# EAGLE schematic stim (EAGLE 7.1.0)
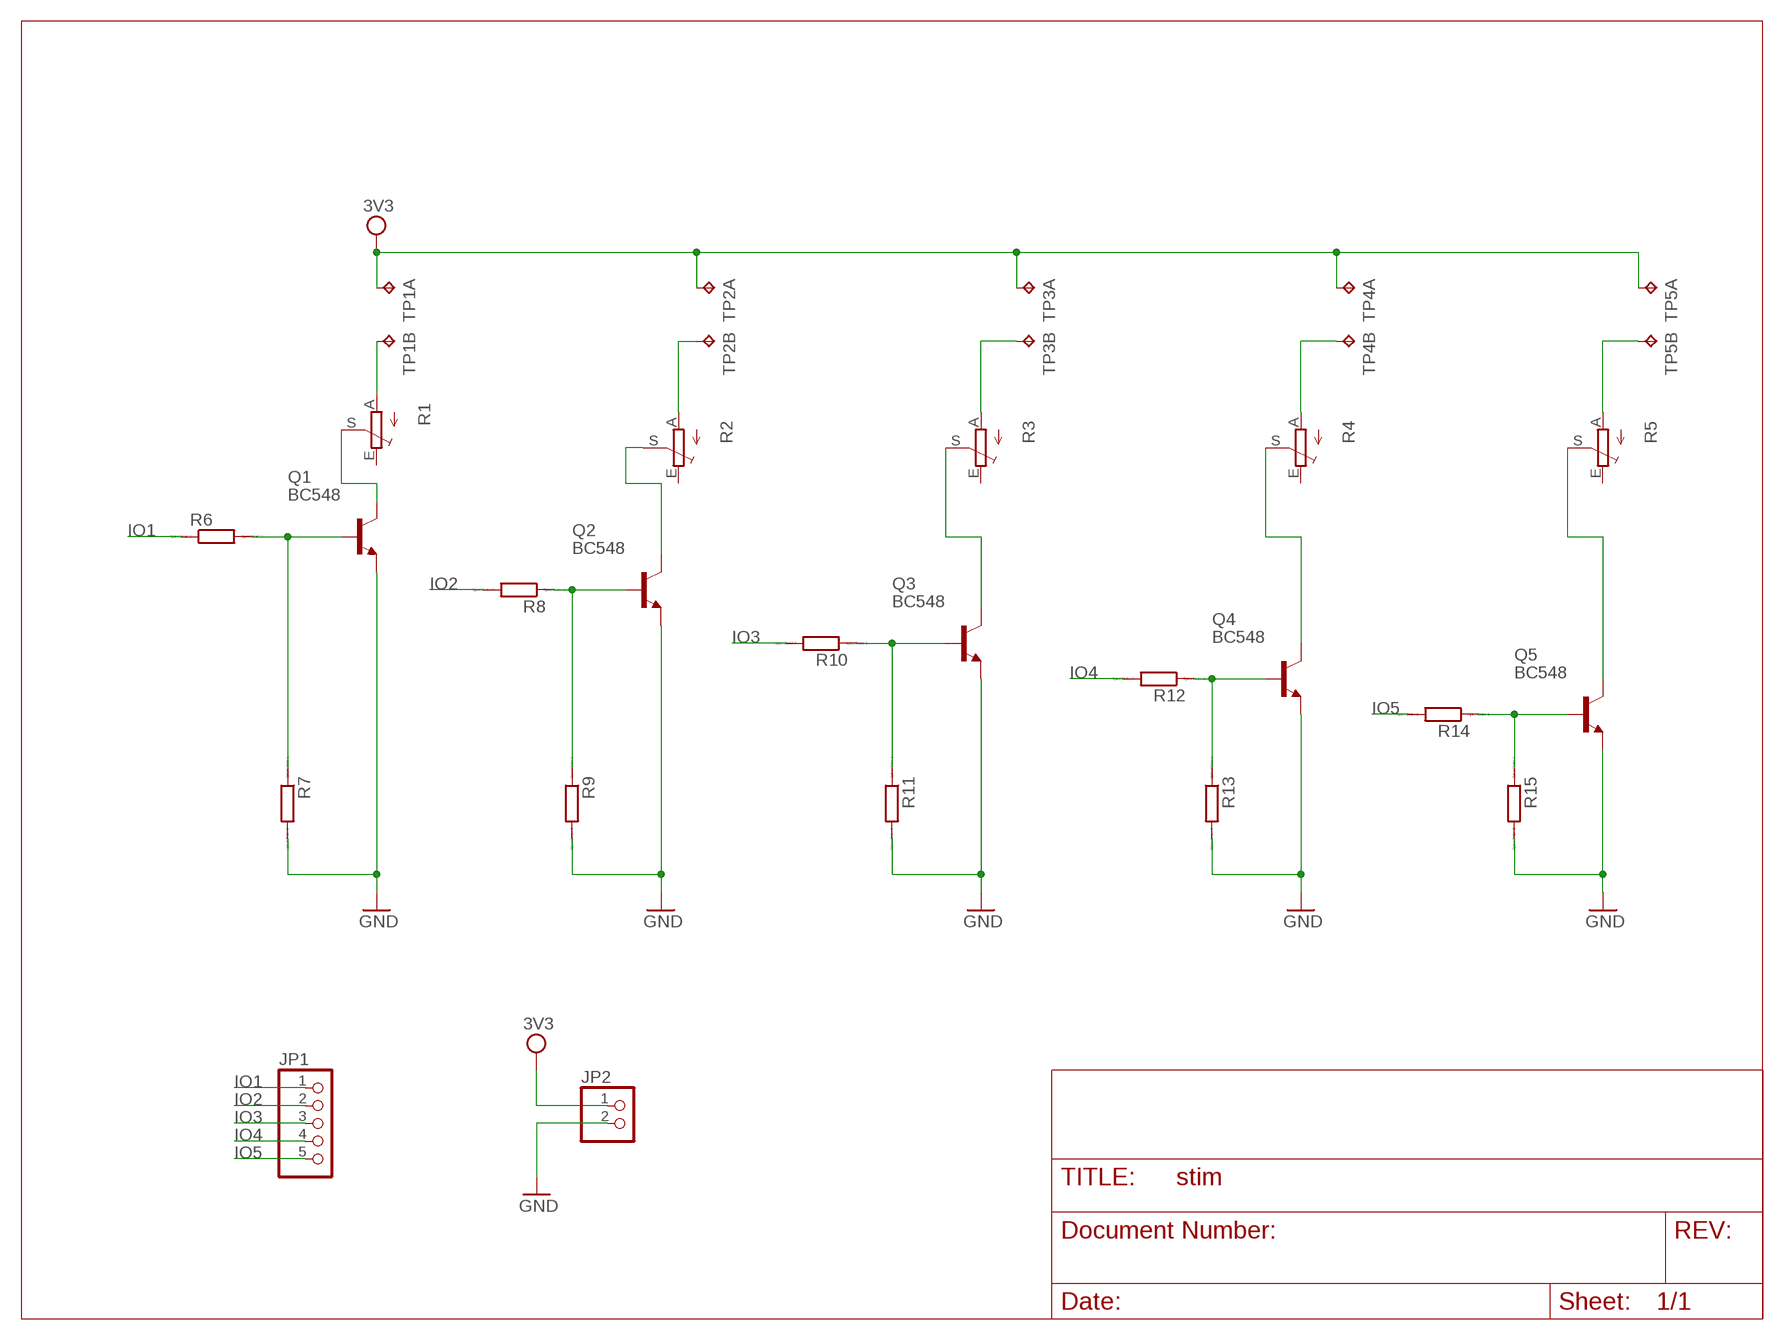
[diagram p0: schematic, sheet 1]

## Parts
JP1  PINHD-1X5  [1X05]
JP2  PINHD-1X2  [1X02]
Q1  BC548  [TO92-EBC]
Q2  BC548  [TO92-EBC]
Q3  BC548  [TO92-EBC]
Q4  BC548  [TO92-EBC]
Q5  BC548  [TO92-EBC]
R1  TRIM_EU-B25V  [B25V]
R2  TRIM_EU-B25V  [B25V]
R3  TRIM_EU-B25V  [B25V]
R4  TRIM_EU-B25V  [B25V]
R5  TRIM_EU-B25V  [B25V]
R6  RR1206  [R1206]
R7  RR1206  [R1206]
R8  RR1206  [R1206]
R9  RR1206  [R1206]
R10  RR1206  [R1206]
R11  RR1206  [R1206]
R12  RR1206  [R1206]
R13  RR1206  [R1206]
R14  RR1206  [R1206]
R15  RR1206  [R1206]
TP1  TP2P2-38-17  [P2-38-17]
TP2  TP2P2-38-17  [P2-38-17]
TP3  TP2P2-38-17  [P2-38-17]
TP4  TP2P2-38-17  [P2-38-17]
TP5  TP2P2-38-17  [P2-38-17]

## Nets
GND: JP2.2 Q1.E Q2.E Q3.E Q4.E Q5.E R7.2 R9.2 R11.2 R13.2 R15.2
IO1: JP1.1 R6.1
IO2: JP1.2 R8.2
IO3: JP1.3 R10.2
IO4: JP1.4 R12.2
IO5: JP1.5 R14.2
N$1: R2.A TP2.TP-2
N$2: R3.A TP3.TP-2
N$3: Q3.C R3.S
N$4: Q1.C R1.S
N$5: Q5.B R14.1 R15.1
N$6: R1.A TP1.TP-2
N$7: R4.A TP4.TP-2
N$8: Q4.C R4.S
N$9: R5.A TP5.TP-2
N$10: Q5.C R5.S
N$11: Q4.B R12.1 R13.1
N$12: Q3.B R10.1 R11.1
N$13: Q2.B R8.1 R9.1
N$15: Q1.B R6.2 R7.1
SDA: Q2.C R2.S
VDD: JP2.1 TP1.TP-1 TP2.TP-1 TP3.TP-1 TP4.TP-1 TP5.TP-1 ; supply symbol labelled 3V3
Unconnected: R1.E R2.E R3.E R4.E R5.E

## Library data of the parts
JP1 = pinhead:PINHD-1X5: PIN HEADER
JP2 = pinhead:PINHD-1X2: PIN HEADER
Q1-Q5 = transistor-npn:BC548*: NPN Transistor
R1-R5 = pot:TRIM_EU-: POTENTIOMETER
R6-R15 = eagle-ltspice:R: RESISTOR, European symbol; SPICEMODEL: NONE; SPICEPREFIX: R
TP1-TP5 = testpad:TP2: Test pad